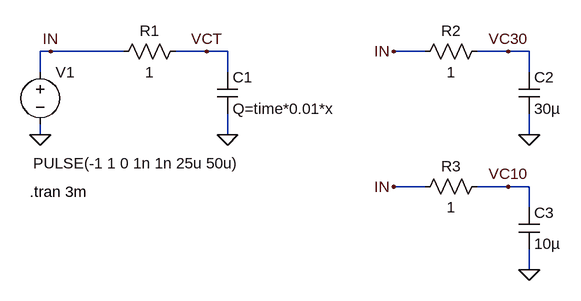
[diagram p0: schematic Fig_2-90_Cap-Q-time.asc]
Fig_2-90_Cap-Q-time.asc, the LTspice schematic file:
Version 4
SHEET 1 916 680
WIRE 32 112 16 112
WIRE 144 112 32 112
WIRE 272 112 224 112
WIRE 304 112 272 112
WIRE 608 112 560 112
WIRE 736 112 688 112
WIRE 768 112 736 112
WIRE 16 144 16 112
WIRE 304 144 304 112
WIRE 768 144 768 112
WIRE 16 240 16 224
WIRE 304 240 304 208
WIRE 768 240 768 208
WIRE 608 320 560 320
WIRE 736 320 688 320
WIRE 768 320 736 320
WIRE 768 352 768 320
WIRE 768 448 768 416
FLAG 16 240 0
FLAG 304 240 0
FLAG 32 112 IN
FLAG 272 112 VCT
FLAG 768 240 0
FLAG 736 112 VC30
FLAG 560 112 IN
FLAG 768 448 0
FLAG 736 320 VC10
FLAG 560 320 IN
SYMBOL voltage 16 128 R0
WINDOW 3 -11 156 Left 2
WINDOW 123 0 0 Left 0
WINDOW 39 0 0 Left 0
SYMATTR Value PULSE(-1 1 0 1n 1n 25u 50u)
SYMATTR InstName V1
SYMBOL res 128 128 R270
WINDOW 0 32 56 VTop 2
WINDOW 3 0 56 VBottom 2
SYMATTR InstName R1
SYMATTR Value 1
SYMBOL cap 288 144 R0
SYMATTR InstName C1
SYMATTR Value Q=time*0.01*x
SYMBOL res 592 128 R270
WINDOW 0 32 56 VTop 2
WINDOW 3 0 56 VBottom 2
SYMATTR InstName R2
SYMATTR Value 1
SYMBOL cap 752 144 R0
SYMATTR InstName C2
SYMATTR Value 30µ
SYMBOL res 592 336 R270
WINDOW 0 32 56 VTop 2
WINDOW 3 0 56 VBottom 2
SYMATTR InstName R3
SYMATTR Value 1
SYMBOL cap 752 352 R0
SYMATTR InstName C3
SYMATTR Value 10µ
TEXT 0 328 Left 2 !.tran 3m

The netlist it stands for:
* Fig_2-90_Cap-Q-time.asc
V1 IN 0 PULSE(-1 1 0 1n 1n 25u 50u)
R1 IN VCT 1
C1 VCT 0 Q=time*0.01*x
R2 IN VC30 1
C2 VC30 0 30µ
R3 IN VC10 1
C3 VC10 0 10µ
.tran 3m
.backanno
.end